# EAGLE design Adafruit MAX31865 (EAGLE 6.6.0)
COMPANY: ADAFRUIT INDUSTRIES; DRAWN: KTOWN; REV: A
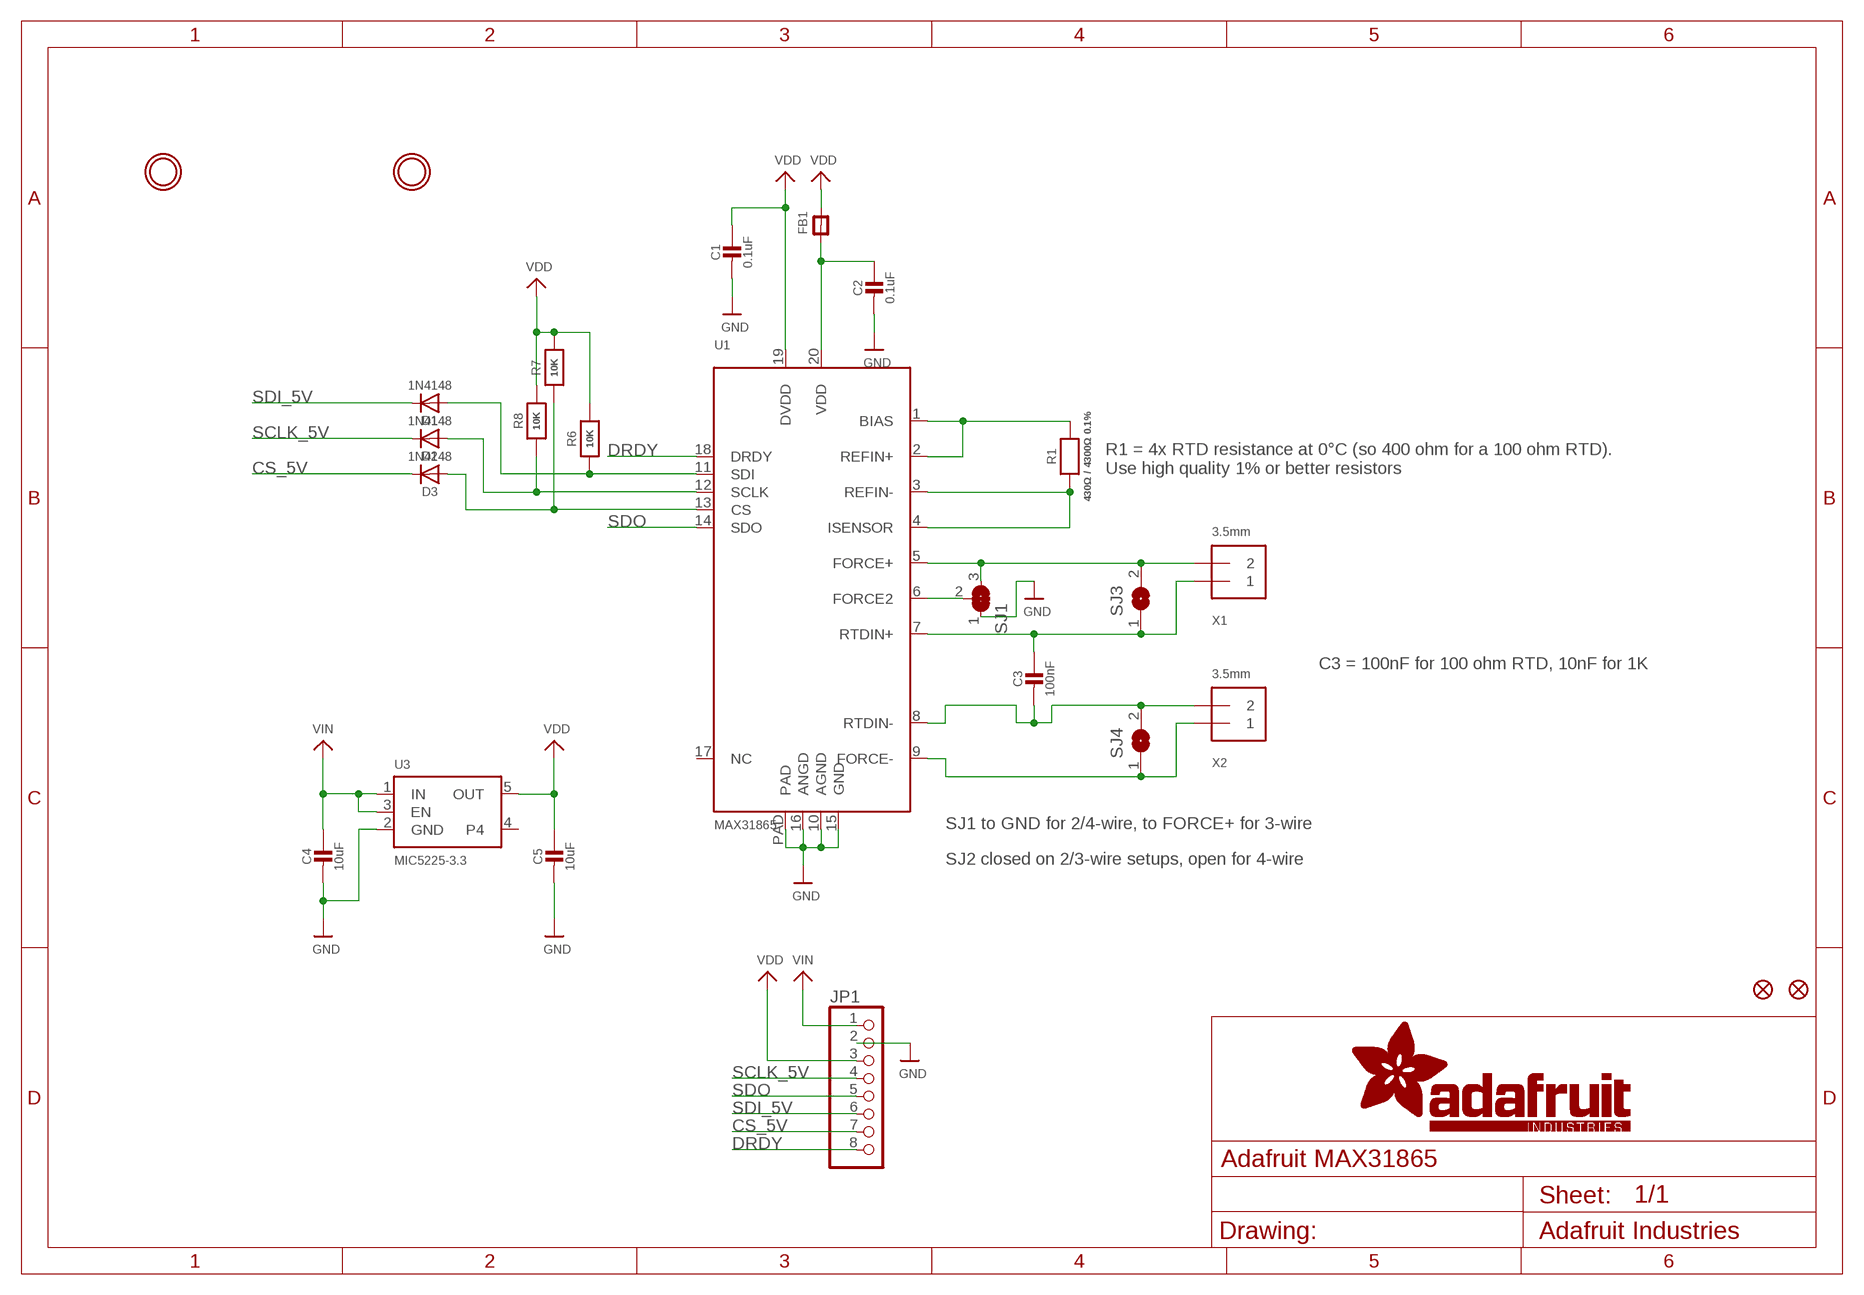
[diagram p0: schematic, sheet 1]

## Parts
C1  0.1uF  CAP_CERAMIC0805-NOOUTLINE  [0805-NO]
C2  0.1uF  CAP_CERAMIC0805-NOOUTLINE  [0805-NO]
C3  100nF  CAP_CERAMIC0805-NOOUTLINE  [0805-NO]
C4  10uF  CAP_CERAMIC0805-NOOUTLINE  [0805-NO]
C5  10uF  CAP_CERAMIC0805-NOOUTLINE  [0805-NO]
D1  1N4148  DIODESOD-323  [SOD-323]
D2  1N4148  DIODESOD-323  [SOD-323]
D3  1N4148  DIODESOD-323  [SOD-323]
FB1  FERRITE-0805NO  [0805-NO]
FID1  FIDUCIAL""  [FIDUCIAL_1MM]
FID2  FIDUCIAL""  [FIDUCIAL_1MM]
JP1  HEADER-1X870MIL  [1X08_ROUND_70]
R1  430Ω / 4300Ω 0.1%  RESISTOR0805_NOOUTLINE  [0805-NO]
R6  10K  RESISTOR0805_NOOUTLINE  [0805-NO]
R7  10K  RESISTOR0805_NOOUTLINE  [0805-NO]
R8  10K  RESISTOR0805_NOOUTLINE  [0805-NO]
SJ1  SOLDERJUMPER_2WAY  [SOLDERJUMPER_2WAY_OPEN_NOPASTE]
SJ3  SOLDERJUMPER  [SOLDERJUMPER_ARROW_NOPASTE]
SJ4  SOLDERJUMPER  [SOLDERJUMPER_ARROW_NOPASTE]
U1  MAX31865  TEMP_MAX31865  [QFN20_4MM_0.65MM]
U3  MIC5225-3.3  VREG_SOT23-5  [SOT23-5]
U$18  MOUNTINGHOLE2.5  [MOUNTINGHOLE_2.5_PLATED]
U$19  MOUNTINGHOLE2.5  [MOUNTINGHOLE_2.5_PLATED]
X1  3.5mm  TERMBLOCK_1X2  [TERMBLOCK_1X2-3.5MM]
X2  3.5mm  TERMBLOCK_1X2  [TERMBLOCK_1X2-3.5MM]

## Nets
CS_5V: D3.C JP1.7
DRDY: JP1.8 U1.18(DRDY)
FORCE+: SJ1.3 SJ3.2 U1.5(FORCE+) X1.2
FORCE-: SJ4.1 U1.9(FORCE-) X2.1
GND: C1.2 C2.2 C4.2 C5.2 JP1.2 SJ1.1 U1.10(AGND) U1.15(GND) U1.16(ANGD) U1.PAD U3.2(GND)
N$1: R1.1 U1.3(REFIN-) U1.4(ISENSOR)
N$2: R1.2 U1.1(BIAS) U1.2(REFIN+)
N$4: C2.1 FB1.1 U1.20(VDD)
N$11: SJ1.2 U1.6(FORCE2)
N$12: D3.A R7.1 U1.13(CS)
N$13: D2.A R8.1 U1.12(SCLK)
N$14: D1.A R6.1 U1.11(SDI)
RTDIN+: C3.1 SJ3.1 U1.7(RTDIN+) X1.1
RTDIN-: C3.2 SJ4.2 U1.8(RTDIN-) X2.2
SCLK_5V: D2.C JP1.4
SDI_5V: D1.C JP1.6
SDO: JP1.5 U1.14(SDO)
VDD: C1.1 C5.1 FB1.2 JP1.3 R6.2 R7.2 R8.2 U1.19(DVDD) U3.5(OUT)
VIN: C4.1 JP1.1 U3.1(IN) U3.3(EN)
Unconnected: U1.17(NC) U3.4

## Notes on the sheet
- R1 = 4x RTD resistance at 0°C (so 400 ohm for a 100 ohm RTD).
  Use high quality 1% or better resistors
- C3 = 100nF for 100 ohm RTD, 10nF for 1K
- SJ1 to GND for 2/4-wire, to FORCE+ for 3-wire
- SJ2 closed on 2/3-wire setups, open for 4-wire

## Library data of the parts
C1-C5 = microbuilder:CAP_CERAMIC: Ceramic Capacitors For new designs, use the packages preceded by an '_' character since they are more reliable: The following footprints should be used on most boards: _0402 - Standard footprint for regular board layouts _0603 - Standard footprint for regular board layouts _0805 - Standard footprint for regular board layouts _1206 - Standard footprint for regular board layouts For extremely tight-pitch boards where space is at a premium, the following 'micro-pitch' footprints can be used (smaller pads, no silkscreen outline, etc.): _0402MP - Micro-pitch footprint for very dense/compact boards _0603MP - Micro-pitch footprint for very dense/compact boards _0805MP - Micro-pitch footprint for very dense/compact boards _1206MP - Micro-pitch footprint for very dense/compact boards
D1-D3 = microbuilder:DIODE: Diode SMA Model Volts Amps Type Vf Ir Digikey # Notes SSA34-E3 40V 3A Schottky 480mV @ 3A 200uA @ 40V SSA34-E3/61TGITR-ND CDBA120-G 20V 1A Schottky 500mV @ 1A 500uA @ 20V 641-1014-6-ND REEL MBRA210 10V 2A Schottky 350mV @ 2A 700uA @ 10V MBRA210LT3 SOD-123 Model Volts Amps Type Vf Ir Order # Notes BAT54T1G 30V 200mA Schottky 800mV @ 200mA 2uA @ 25V BAT54T1GOSTR-ND B0530W 30V 500mA Schottky 430mV @ 500mA 130uA @ 30V B0530W-FDICT-ND REEL MBR120 20V 1A Schottky 340mV @ 1A MBR120VLSFT1GOSCT-ND SOD-323 Model Volts Amps Type Vf Ir Order # Notes PMEG2005EJ 20V 500mA Schottky 355mV @ 500mA 568-4110-1-ND ZLLS410 10V 570mA Schottky 380mV @ 570mA ZLLS410CT-ND 1N4148WS 75V 150mA Silicon/Simple 1V 1N4148WSFSCT-ND REEL SOD-523 Model Volts Amps Type Vf Ir Order # Notes BAT54XV2 30V 200mA Schottky 0.8V @ 100mA BAT54XV2CT-ND TB751S 30V 30mA Schottky RB751S-40TE61CT-ND SOT23-R/W (R = Solder Paste/Reflow Ovens, W = Hand-Soldering) Model Volts Amps Type Vf Ir Order # Notes BAT54FILM 40V 300mA Schottky 497-7162-1-ND POWERDI-5 Model Volts Amps Type Vf Ir Order # Notes PDS560 60V 5A Schottky 670mV @ 5A 150uA @ 60V PDS560DICT-ND
FB1 = microbuilder:FERRITE: Ferrite Bead 0603 MMZ1608B121C - 120 Ohm @ 100MHz, 600mA, 0.15 Ohm DC Resistance - Digikey: 445-2164-1-ND BK1608HW121-T - 120 Ohm, 600mA Ferrite Chip - Digikey: 587-1876-2-ND 0805 HZ0805B272R-10 - 2.7K Ohm @ 100MHz, 200mA, 0.8 Ohm DC Resistance - Digikey: 240-2504-1-ND (see also Murata BLM21BD272SN1L) MMZ2012Y152B - 1.5K Ohm @ 100MHz, 500mA, 0.4 Ohm DC Resistance - Digikey: 445-1560-1-ND - Mainly for high frequency (80-400MHz) MMZ2012R102A - 1K Ohm @ 100MHz, 500mA, 0.3 Ohm DC Resistance - Digikey: 445-1555-2-ND - More general purpose (10-200MHz)
FID1 FID2 = microbuilder:FIDUCIAL: Fiducial Alignment Points Various fiducial points for machine vision alignment.; BOM: EXCLUDE
JP1 = microbuilder:HEADER-1X8: PIN HEADER
R1 R6-R8 = microbuilder:RESISTOR: Resistors For new designs, use the packages preceded by an '_' character since they are more reliable: The following footprints should be used on most boards: _0402 - Standard footprint for regular board layouts _0603 - Standard footprint for regular board layouts _0805 - Standard footprint for regular board layouts _1206 - Standard footprint for regular board layouts For extremely tight-pitch boards where space is at a premium, the following 'micro-pitch' footprints can be used (smaller pads, no silkscreen outline, etc.): _0402MP - Micro-pitch footprint for very dense/compact boards _0603MP - Micro-pitch footprint for very dense/compact boards _0805MP - Micro-pitch footprint for very dense/compact boards _1206MP - Micro-pitch footprint for very dense/compact boards
SJ1 = microbuilder:SOLDERJUMPER_2WAY: 2-Way Solder Jumper
SJ3 SJ4 = microbuilder:SOLDERJUMPER: SMD Solder JUMPER Solder the two pads together to create a connection, or remove the solder to break it. REFLOW - Use this footprint for solder paste and reflow ovens. WAVE - Use this footprint for hand-soldering (larger pads). CLOSED - Has a trace between the two pads to ensure it is closed by default. The trace needs to be cut to disable the jumper, and can be closed again by creating a solder bridge between the two pads.; BOM: EXCLUDE
U1 = microbuilder:TEMP_MAX31865: MAX31865 - Resistance to Digital Convertor for Platinum Resistance Temperature Detectors (RTDs) Handles 100 ohm - 1K ohm (at 0°C) platinum RTDs. 15-bit ADC resolution (nominally 0.03125°C), 0.5°C accuracy.
U3 = microbuilder:VREG_SOT23-5: SOT23-5 Fixed Voltage Regulators Part Current Out V Out V In V Dropout θJA (°C/W) TJ (°C) Digikey Part No. ADP121 150mA 3.3V 3.4-5.5V 0.09V @ 150mA -- -- ADP121-AUJZ33R7CT-ND ADP121 150mA 3.0V 3.1-5.5V 0.09V @ 150mA -- -- ADP121-AUJZ30R7CT-ND ADP122 300mA 3.3V 3.4-5.5V 0.085V @ 300mA -- -- ADP122AUJZ-3.3-R7CT-ND ADP1712 300mA 3.3V 3.5-5.5V 0.17V @ 300mA -- -- ADP1712AUJZ-3.3-R7TR-ND AP7311 (Low Cost) 150mA 3.3V 3.5-6V 0.15V @ 150mA -- -- AP7311-33WG-7DICT-ND LD39015M18R 150mA 1.8V 1.9V-5.5V 0.08V @ 100mA -- -- 497-6977-1-ND LP2985A-33DBVR 150mA 3.3V 3.3-16V 0.28V @ 150mA 206 150 296-18479-1-ND MCP1824T-3302E/OT 300mA 3.3V 3.5V-6V 0.2V @ 300mA -- -- MCP1824T-3302E/OTCT-ND MIC5205-2.5YM5 TR 150mA 2.5V 2.7-16V 0.165V @ 150mA -- -- 576-1257-2-ND MIC5205-3.0YM5 TR 150mA 3.0V 3.2V-16V 0.165V @ 150mA -- -- 576-1258-2-ND MIC5205-3.3YM5 TR 150mA 3.3V 3.5V-16V 0.165V @ 150mA -- -- 576-1259-2-ND TPS780330220 150mA 3.3V+2.2V 3.6-5.5V 250mV Max -- -- 296-23332-1-ND TDA3663/N1,135 100mA 3.3V 3.5-45V 0.18V @ 50mA -- -- 568-5343-1-ND Max operating temp can be calculated using θJA, TJ (max junction temperature), and power in watts. Set the "Maximum Ambient Temperature" until it reaches TJ ("Max Junction Temperature"), which is the absolute limit for safe use of the regulator: Heat Sink Temperature Calculator <http://www.daycounter.com/Calculators/Heat-Sink-Temperature-Calculator.phtml> For example, With 12V source into a 3.3V LP2985 and a 30mA load, we are dissipating (12V-3.3V) * 0.03A = 0.261W. With a θJA of 206 °C/W, a TJ of 150°C, and 261mW we can safely use the chip without a heat sink up to 75°C (=147.1°C Junction Temperature).
U$18 U$19 = microbuilder:MOUNTINGHOLE: Mounting Hole For #2 screws (0.086"/2.18mm width, 0.094"/2.4mm hole) use 2.5mm; BOM: EXCLUDE
X1 X2 = microbuilder:TERMBLOCK_1X2: 3.5mm Terminal block http://www.ladyada.net/library/pcb/eaglelibrary.html

## Board
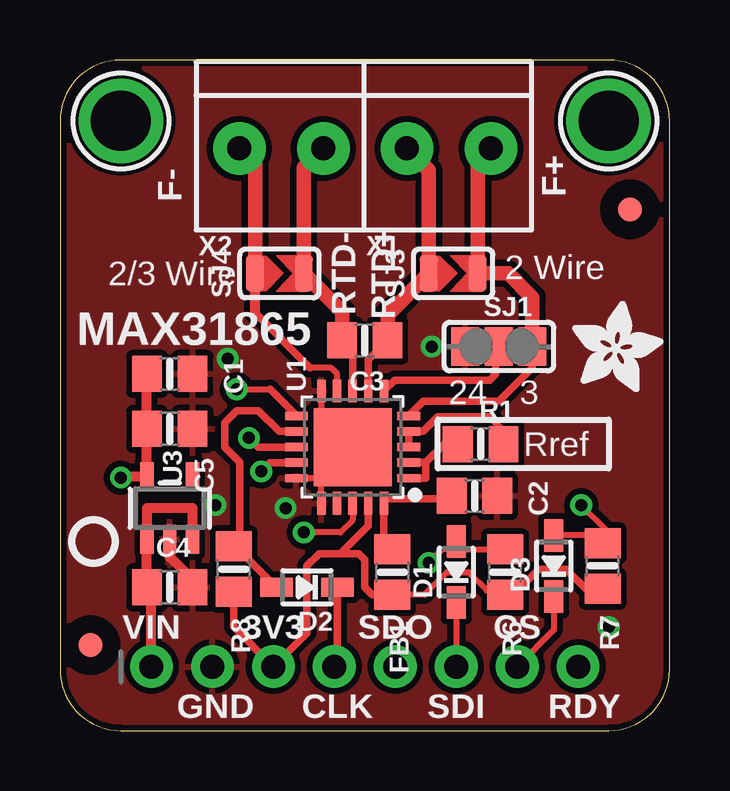
[diagram p1: board, top side]
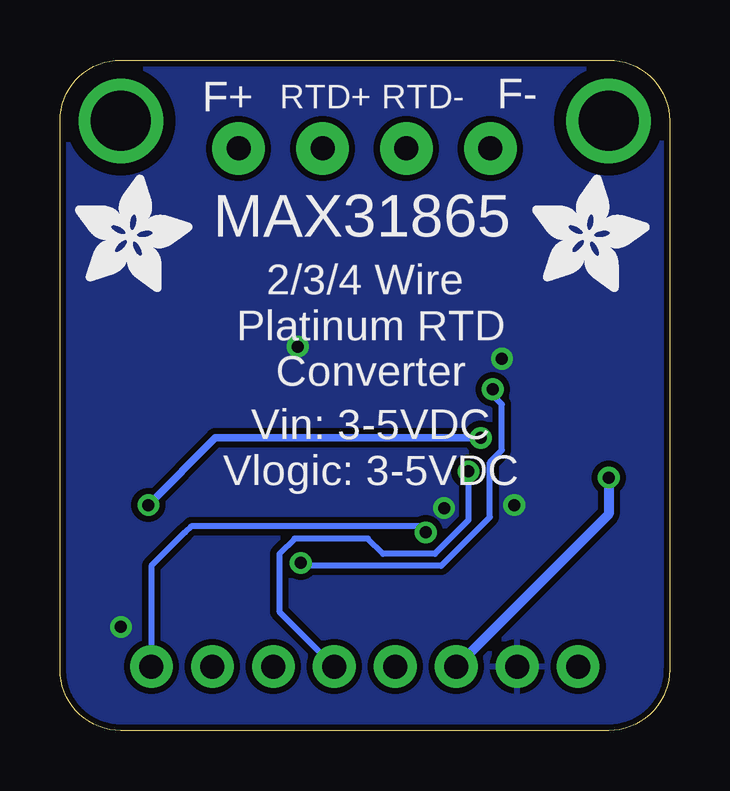
[diagram p2: board, bottom side, seen from below]

Size 25.4 x 27.94 mm. Coordinates in mm from the lower left corner, seen from the top.
Outline: 2.54,0 22.86,0 arc90 25.4,2.54 25.4,25.4 arc90 22.86,27.94 2.54,27.94 arc90 0,25.4 0,2.54 arc90 2.54,0
Copper layers (1*16): Top 0.035mm / dielectric 1.5mm / Bottom 0.035mm
Design rules "adafruit *": minimum track width 8mil, minimum drill 15.5mil, track to track 8mil, track to pad 8mil, pad to pad 8mil, via to via 8mil, smd to smd 8mil, copper to edge 10mil, drill to drill 8mil, minimum pad ring 10mil, minimum via ring 8mil, stop-mask expansion 2mil, vias tented up to drill 20mil, thermal gap 10mil

### Footprints (pad centres in the part's own frame; a part is rotated, then mirrored left to right if it is on the bottom)
0805-NO = smd 1.24 x 1.5: 1 -0.95,0; 2 0.95,0
SOD-323 = smd 1.35 x 0.8: A 1.27,0; C -1.27,0
FIDUCIAL_1MM = smd 1 x 1: 1 0,0
1X08_ROUND_70 = drill 1 pad 1.778: 1 -8.89,0; 2 -6.35,0; 3 -3.81,0; 4 -1.27,0; 5 1.27,0; 6 3.81,0; 7 6.35,0; 8 8.89,0
SOLDERJUMPER_2WAY_OPEN_NOPASTE = smd 1.168 x 1.6: 1 -1.397,0; 2 0,0; 3 1.397,0
SOLDERJUMPER_ARROW_NOPASTE = smd 0.762 x 1.524: 1 -1.016,0; 2 1.016,0
QFN20_4MM_0.65MM = smd 0.35 x 0.95: 1 -1.3,-2.34; 2 -0.65,-2.34; 3 0,-2.34; 4 0.65,-2.34; 5 1.3,-2.34; 11 1.3,2.34; 12 0.65,2.34; 13 0,2.34; 14 -0.65,2.34; 15 -1.3,2.34 | smd 0.95 x 0.35: 6 2.34,-1.3; 7 2.34,-0.65; 8 2.34,0; 9 2.34,0.65; 10 2.34,1.3; 16 -2.34,1.3; 17 -2.34,0.65; 18 -2.34,0; 19 -2.34,-0.65; 20 -2.34,-1.3 | smd 3.25 x 3.25: PAD 0,0
SOT23-5 = smd 0.55 x 1.2: 1 -0.95,-1.3; 2 0,-1.3; 3 0.95,-1.3; 4 0.95,1.3; 5 -0.95,1.3
MOUNTINGHOLE_2.5_PLATED = drill 2.5 pad 3.2: P$1 0,0
TERMBLOCK_1X2-3.5MM = drill 1 pad 2.184: 1 1.8,0; 2 -1.7,0

### Placement (x,y rotation side)
C1  4.57,14.86 0 top
C2  17.27,9.78 0 top
C3  12.7,16.26 180 top
C4  4.57,5.97 0 top
C5  4.57,12.57 0 top
D1  16.51,6.6 90 top
D2  10.29,5.97 180 top
D3  20.57,6.86 90 top
FB1  13.84,6.6 270 top
FID1  23.75,21.72 90 top
FID2  1.27,3.56 90 top
JP1  12.7,2.67 0 top
R1  17.53,11.94 180 top
R6  18.54,6.6 270 top
R7  22.61,6.86 270 top
R8  7.24,6.73 270 top
SJ1  18.29,16 0 top
SJ3  16.38,19.05 0 top
SJ4  9.14,19.05 0 top
U1  12.19,11.81 90 top
U3  4.57,9.27 0 top
U$8  [PCBFEAT-REV-040]  1.4,7.87 0 top
U$16  [ADAFRUIT_3.5MM]  21.34,14.1 0 top
U$18  2.54,25.4 0 top
U$19  22.86,25.4 0 top
U$20  [ADAFRUIT_5MM]  5.71,18.29 0 bottom
U$21  [ADAFRUIT_5MM]  24.77,18.29 0 bottom
X1  16.26,24.26 180 top
X2  9.27,24.26 180 top

### Tracks (layer width: path | path; a pad name or v marks a point on that pad's centre or on a via)
CS_5V
  Top 0.254: D3.C 20.57,4.19 JP1.7
DRDY  (via drill 0.5)
  Top 0.254: U1.18 12.19,8.76 11.68,8.26 v10.16,8.26
  Bottom 0.254: v10.16,8.26 10.41,8.51 19.94,8.51 20.19,8.26 21.59,6.86 JP1.8
FORCE+
  Top 0.305: U1.5 15.14,13.72 18.29,13.72 19.68,15.11 SJ1.3
  Top 0.61: X1.2 17.4,23.7 SJ3.2 18.67,19.05 19.68,18.03 SJ1.3
FORCE-
  Top 0.254: U1.9 11.54,14.87 11.3,15.11 10.41,15.11
  Top 0.305: 10.41,15.11 8.13,17.4
  Top 0.406: 8.13,17.4 SJ4.1
  Top 0.61: SJ4.1 8.13,23.6 X2.1
GND  (via drill 0.5)
  Top 0.254: U1.16 10.89,10.77 | U1.10 10.89,13.37 | U1.PAD 10.89,10.51 U1.15
  Top 0.305: U1.PAD 13.08,10.92
  Top 0.406: U3.2 4.57,7.24 5.52,6.29 C4.2
  other vias: 15.49,16 22.86,4.32 9.4,9.27 6.99,15.49 6.48,9.4
  pour Top (isolate 0.254): 0,0 0,27.94 25.53,27.94 25.53,0
  pour Bottom (isolate 0.254): 0,0 0,27.94 25.53,27.94 25.53,0
N$1
  Top 0.254: 18.16,12.83 18.48,12.51 R1.1
  Top 0.305: U1.3 U1.4 15.13,12.46 15.75,13.08 17.91,13.08 18.16,12.83
N$2
  Top 0.305: U1.1 15.24,10.51 15.24,11.18 | 15.24,11.18 14.53,11.18 U1.2 | 15.24,11.18 16,11.94 R1.2
N$3
  Top 0.254: 16.89,16 18.29,16
N$4
  Top 0.254: U1.20 13.49,9.65
  Top 0.305: 13.49,9.65 16.2,9.65 C2.1 | U1.20 13.49,7.91 FB1.1
N$11
  Top 0.305: U1.6 13.95,14.61 17.91,14.61 18.16,14.86 18.16,15.88 SJ1.2
N$12  (via drill 0.5)
  Top 0.254: R7.1 22.29,8.13 D3.A | 22.73,7.93 22.73,8.38 v21.72,9.4
  Top 0.305: U1.13 8.26,11.81 v7.87,12.19 | 22.73,7.93 R7.1
  Bottom 0.305: v7.87,12.19 18.92,12.19 v21.72,9.4
N$13
  Top 0.305: U1.12 9.13,12.46 8.26,13.34 7.37,13.34 6.86,12.83 6.86,11.81 7.49,11.18 7.49,7.93 R8.1 7.3,7.68 D2.A
N$14  (via drill 0.5)
  Top 0.254: D1.A 16.51,7.55 | 16.51,7.55 R6.1 | v7.37,14.22 8.76,14.22 | 16.51,7.55 15.94,7.55 v15.37,6.99
  Top 0.305: 8.76,14.22 9.85,13.13 U1.11
  Bottom 0.254: v7.37,14.22 7.62,14.22 6.99,13.59 6.99,11.68 7.49,11.18 7.49,8.89 9.53,6.86 15.24,6.86 v15.37,6.99
RTDIN+
  Top 0.305: U1.7 12.84,15.45 C3.1
  Top 0.61: X1.1 15.37,23.35 SJ3.1 13.65,17.33 C3.1
RTDIN-
  Top 0.305: 11.75,15.94 C3.2 12.19,15.81 U1.8
  Top 0.61: X2.2 10.16,23.45 SJ4.2 11.75,17.46 C3.2
SCLK_5V
  Top 0.305: D2.C 11.56,2.67 JP1.4
SDI_5V
  Top 0.254: D1.C JP1.6
SDO  (via drill 0.5)
  Top 0.305: U1.14 8.75,11.16 v8.38,10.79
  Bottom 0.254: v8.38,10.79 8.38,8.76 9.78,7.37 11.94,7.37 12.57,8 15.62,8 16.26,7.37 16.26,4.95 JP1.5 14.1,2.79
  Bottom 0.305: 14.22,2.92 JP1.5
VDD  (via drill 0.5)
  Top 0.254: R6.2 18.35,5.84 17.78,5.84 17.02,6.6 16.13,6.6 15.18,5.65 FB1.2
  Top 0.305: R6.2 18.86,5.65 18.92,5.71 | R7.2 22.54,5.84 21.97,5.84 21.08,6.73 19.94,6.73 18.92,5.71 | 18.92,5.71 18.41,5.71 | U1.19 12.84,8.52 11.68,7.37 | 11.68,7.37 10.79,7.37 10.29,6.86 10.29,4.06 JP1.3 7.24,4.32 R8.2 | FB1.2 13.02,5.65 12.7,5.97 12.7,7.11 12.45,7.37 11.68,7.37
  Top 0.406: C1.1 C5.1 U3.5 2.57,10.57 v2.54,10.54
  Bottom 0.406: v2.54,10.54 2.54,9.02 JP1.3
VIN
  Top 0.406: JP1.1 3.81,5.78 C4.1 U3.1 3.62,9.27 5.52,9.27 U3.3

### Text on the board
tPlace: F- | F+ | 2/3 Wire | RTD- | RTD+ | 2 Wire | MAX31865 | 24 | 3 | Rref | VIN | 3V3 | SDO | CS | GND | CLK | SDI | RDY
bPlace: F- | RTD- | RTD+ | F+ | MAX31865 | 2/3/4 Wire / Platinum RTD / Converter | Vin: 3-5VDC / Vlogic: 3-5VDC